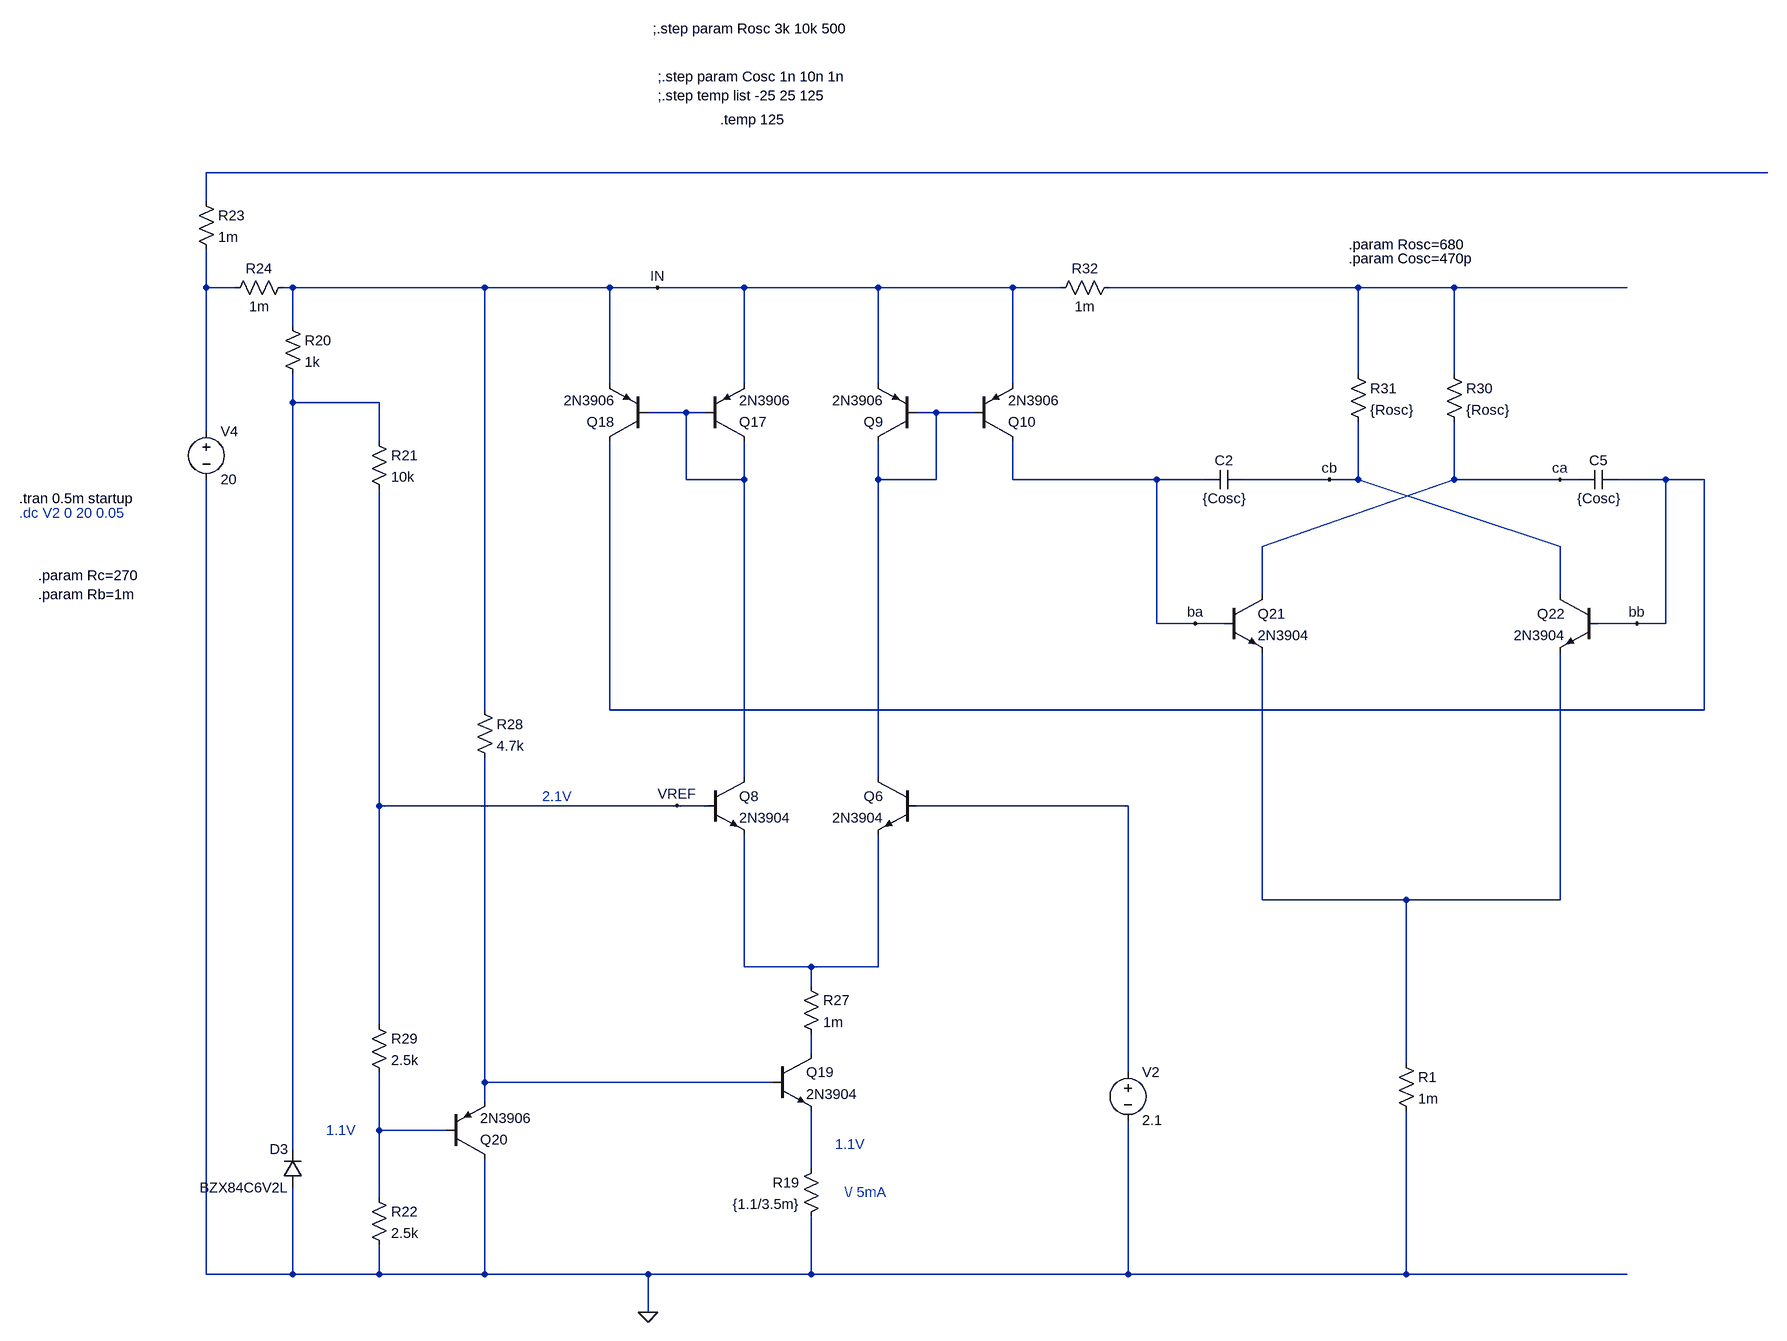
[diagram p0: schematic step_down2.asc]
step_down2.asc, the LTspice schematic file:
Version 4.1
SHEET 1 4228 6340
WIRE 3584 4416 560 4416
WIRE 560 4464 560 4416
WIRE 560 4608 560 4544
WIRE 608 4608 560 4608
WIRE 704 4608 688 4608
WIRE 1024 4608 704 4608
WIRE 1232 4608 1024 4608
WIRE 1312 4608 1232 4608
WIRE 1456 4608 1312 4608
WIRE 1680 4608 1456 4608
WIRE 1904 4608 1680 4608
WIRE 1984 4608 1904 4608
WIRE 2480 4608 2064 4608
WIRE 2640 4608 2480 4608
WIRE 2928 4608 2640 4608
WIRE 704 4672 704 4608
WIRE 2480 4752 2480 4608
WIRE 2640 4752 2640 4608
WIRE 1232 4768 1232 4608
WIRE 1456 4768 1456 4608
WIRE 1680 4768 1680 4608
WIRE 1904 4768 1904 4608
WIRE 704 4800 704 4752
WIRE 848 4800 704 4800
WIRE 1360 4816 1296 4816
WIRE 1392 4816 1360 4816
WIRE 1776 4816 1744 4816
WIRE 1840 4816 1776 4816
WIRE 560 4848 560 4608
WIRE 848 4864 848 4800
WIRE 1360 4928 1360 4816
WIRE 1456 4928 1456 4864
WIRE 1456 4928 1360 4928
WIRE 1680 4928 1680 4864
WIRE 1776 4928 1776 4816
WIRE 1776 4928 1680 4928
WIRE 1904 4928 1904 4864
WIRE 2144 4928 1904 4928
WIRE 2224 4928 2144 4928
WIRE 2432 4928 2288 4928
WIRE 2480 4928 2480 4832
WIRE 2480 4928 2432 4928
WIRE 2640 4928 2640 4832
WIRE 2816 4928 2640 4928
WIRE 2848 4928 2816 4928
WIRE 2992 4928 2912 4928
WIRE 3056 4928 2992 4928
WIRE 2320 5040 2640 4928
WIRE 2816 5040 2480 4928
WIRE 2320 5120 2320 5040
WIRE 2816 5120 2816 5040
WIRE 2144 5168 2144 4928
WIRE 2208 5168 2144 5168
WIRE 2256 5168 2208 5168
WIRE 2944 5168 2880 5168
WIRE 2992 5168 2992 4928
WIRE 2992 5168 2944 5168
WIRE 1024 5312 1024 4608
WIRE 1232 5312 1232 4864
WIRE 3056 5312 3056 4928
WIRE 3056 5312 1232 5312
WIRE 1456 5424 1456 4928
WIRE 1680 5424 1680 4928
WIRE 848 5472 848 4944
WIRE 1344 5472 848 5472
WIRE 1392 5472 1344 5472
WIRE 2096 5472 1744 5472
WIRE 2320 5632 2320 5216
WIRE 2560 5632 2320 5632
WIRE 2816 5632 2816 5216
WIRE 2816 5632 2560 5632
WIRE 1456 5744 1456 5520
WIRE 1568 5744 1456 5744
WIRE 1680 5744 1680 5520
WIRE 1680 5744 1568 5744
WIRE 1568 5776 1568 5744
WIRE 848 5840 848 5472
WIRE 1568 5888 1568 5856
WIRE 2560 5904 2560 5632
WIRE 2096 5920 2096 5472
WIRE 1024 5936 1024 5392
WIRE 1504 5936 1024 5936
WIRE 1024 5968 1024 5936
WIRE 848 6016 848 5920
WIRE 960 6016 848 6016
WIRE 704 6048 704 4800
WIRE 1568 6080 1568 5984
WIRE 848 6128 848 6016
WIRE 560 6256 560 4928
WIRE 704 6256 704 6112
WIRE 704 6256 560 6256
WIRE 848 6256 848 6208
WIRE 848 6256 704 6256
WIRE 1024 6256 1024 6064
WIRE 1024 6256 848 6256
WIRE 1296 6256 1024 6256
WIRE 1568 6256 1568 6160
WIRE 1568 6256 1296 6256
WIRE 2096 6256 2096 6000
WIRE 2096 6256 1568 6256
WIRE 2560 6256 2560 5984
WIRE 2560 6256 2096 6256
WIRE 2928 6256 2560 6256
WIRE 1296 6320 1296 6256
FLAG 1296 6320 0
FLAG 1312 4608 IN
FLAG 1344 5472 VREF
FLAG 2816 4928 ca
FLAG 2432 4928 cb
FLAG 2208 5168 ba
FLAG 2944 5168 bb
SYMBOL voltage 560 4832 R0
SYMATTR InstName V4
SYMATTR Value 20
SYMBOL res 1584 6064 M0
SYMATTR InstName R19
SYMATTR Value {1.1/3.5m}
SYMBOL npn 1744 5424 M0
SYMATTR InstName Q6
SYMATTR Value 2N3904
SYMBOL npn 1392 5424 R0
SYMATTR InstName Q8
SYMATTR Value 2N3904
SYMBOL pnp 1744 4864 R180
SYMATTR InstName Q9
SYMATTR Value 2N3906
SYMBOL pnp 1840 4864 M180
SYMATTR InstName Q10
SYMATTR Value 2N3906
SYMBOL pnp 1392 4864 M180
SYMATTR InstName Q17
SYMATTR Value 2N3906
SYMBOL pnp 1296 4864 R180
SYMATTR InstName Q18
SYMATTR Value 2N3906
SYMBOL diode 720 6112 R180
WINDOW 0 24 64 Left 2
WINDOW 3 24 0 Left 2
SYMATTR InstName D3
SYMATTR Value BZX84C6V2L
SYMBOL res 688 4656 R0
SYMATTR InstName R20
SYMATTR Value 1k
SYMBOL res 832 4848 R0
SYMATTR InstName R21
SYMATTR Value 10k
SYMBOL res 832 6112 R0
SYMATTR InstName R22
SYMATTR Value 2.5k
SYMBOL voltage 2096 5904 R0
WINDOW 123 0 0 Left 0
WINDOW 39 0 0 Left 0
SYMATTR InstName V2
SYMATTR Value 2.1
SYMBOL res 544 4448 R0
SYMATTR InstName R23
SYMATTR Value 1m
SYMBOL res 592 4624 R270
WINDOW 0 32 56 VTop 2
WINDOW 3 0 56 VBottom 2
SYMATTR InstName R24
SYMATTR Value 1m
SYMBOL res 1552 5760 R0
SYMATTR InstName R27
SYMATTR Value 1m
SYMBOL npn 1504 5888 R0
SYMATTR InstName Q19
SYMATTR Value 2N3904
SYMBOL res 1008 5296 R0
SYMATTR InstName R28
SYMATTR Value 4.7k
SYMBOL pnp 960 6064 M180
SYMATTR InstName Q20
SYMATTR Value 2N3906
SYMBOL res 832 5824 R0
SYMATTR InstName R29
SYMATTR Value 2.5k
SYMBOL npn 2256 5120 R0
SYMATTR InstName Q21
SYMATTR Value 2N3904
SYMBOL npn 2880 5120 M0
SYMATTR InstName Q22
SYMATTR Value 2N3904
SYMBOL cap 2288 4944 M270
WINDOW 0 32 32 VTop 2
WINDOW 3 0 32 VBottom 2
SYMATTR InstName C2
SYMATTR Value {Cosc}
SYMBOL cap 2912 4944 M270
WINDOW 0 32 32 VTop 2
WINDOW 3 0 32 VBottom 2
SYMATTR InstName C5
SYMATTR Value {Cosc}
SYMBOL res 2624 4736 R0
SYMATTR InstName R30
SYMATTR Value {Rosc}
SYMBOL res 2464 4736 R0
SYMATTR InstName R31
SYMATTR Value {Rosc}
SYMBOL res 1968 4624 R270
WINDOW 0 32 56 VTop 2
WINDOW 3 0 56 VBottom 2
SYMATTR InstName R32
SYMATTR Value 1m
SYMBOL res 2544 5888 R0
SYMATTR InstName R1
SYMATTR Value 1m
TEXT 248 4960 Left 2 !.tran 0.5m startup
TEXT 280 5088 Left 2 !.param Rc=270
TEXT 280 5120 Left 2 !.param Rb=1m
TEXT 2464 4536 Left 2 !.param Rosc=680
TEXT 1304 4176 Left 2 !;.step param Rosc 3k 10k 500
TEXT 2464 4560 Left 2 !.param Cosc=470p
TEXT 1312 4256 Left 2 !;.step param Cosc 1n 10n 1n
TEXT 1312 4288 Left 2 !;.step temp list -25 25 125
TEXT 1416 4328 Left 2 !.temp 125
TEXT 248 4984 Left 2 ;.dc V2 0 20 0.05
TEXT 760 6016 Left 2 ;1.1V
TEXT 1608 6040 Left 2 ;1.1V
TEXT 1624 6120 Left 2 ;\\/ 5mA
TEXT 1120 5456 Left 2 ;2.1V

The netlist it stands for:
* step_down2.asc
V4 N002 0 20
R19 N013 0 {1.1/3.5m}
Q6 N006 N007 N009 0 2N3904
Q8 N005 VREF N009 0 2N3904
Q9 N006 N006 IN 0 2N3906
Q10 ba N006 IN 0 2N3906
Q17 N005 N005 IN 0 2N3906
Q18 bb N005 IN 0 2N3906
D3 0 N004 BZX84C6V2L
R20 IN N004 1k
R21 N004 VREF 10k
R22 N012 0 2.5k
V2 N007 0 2.1
R23 N001 N002 1m
R24 N002 IN 1m
R27 N009 N010 1m
Q19 N010 N011 N013 0 2N3904
R28 IN N011 4.7k
Q20 0 N012 N011 0 2N3906
R29 VREF N012 2.5k
Q21 ca ba N008 0 2N3904
Q22 cb bb N008 0 2N3904
C2 cb ba {Cosc}
C5 bb ca {Cosc}
R30 N003 ca {Rosc}
R31 N003 cb {Rosc}
R32 IN N003 1m
R1 N008 0 1m
.model D D
.lib standard.dio
.model NPN NPN
.model PNP PNP
.lib standard.bjt
.tran 0.5m startup
.param Rc=270
.param Rb=1m
.param Rosc=680
;.step param Rosc 3k 10k 500
.param Cosc=470p
;.step param Cosc 1n 10n 1n
;.step temp list -25 25 125
.temp 125
* .dc V2 0 20 0.05
* 1.1V
* 1.1V
* \/ 5mA
* 2.1V
.backanno
.end